# EAGLE design GL42 (EAGLE 6.5.0)
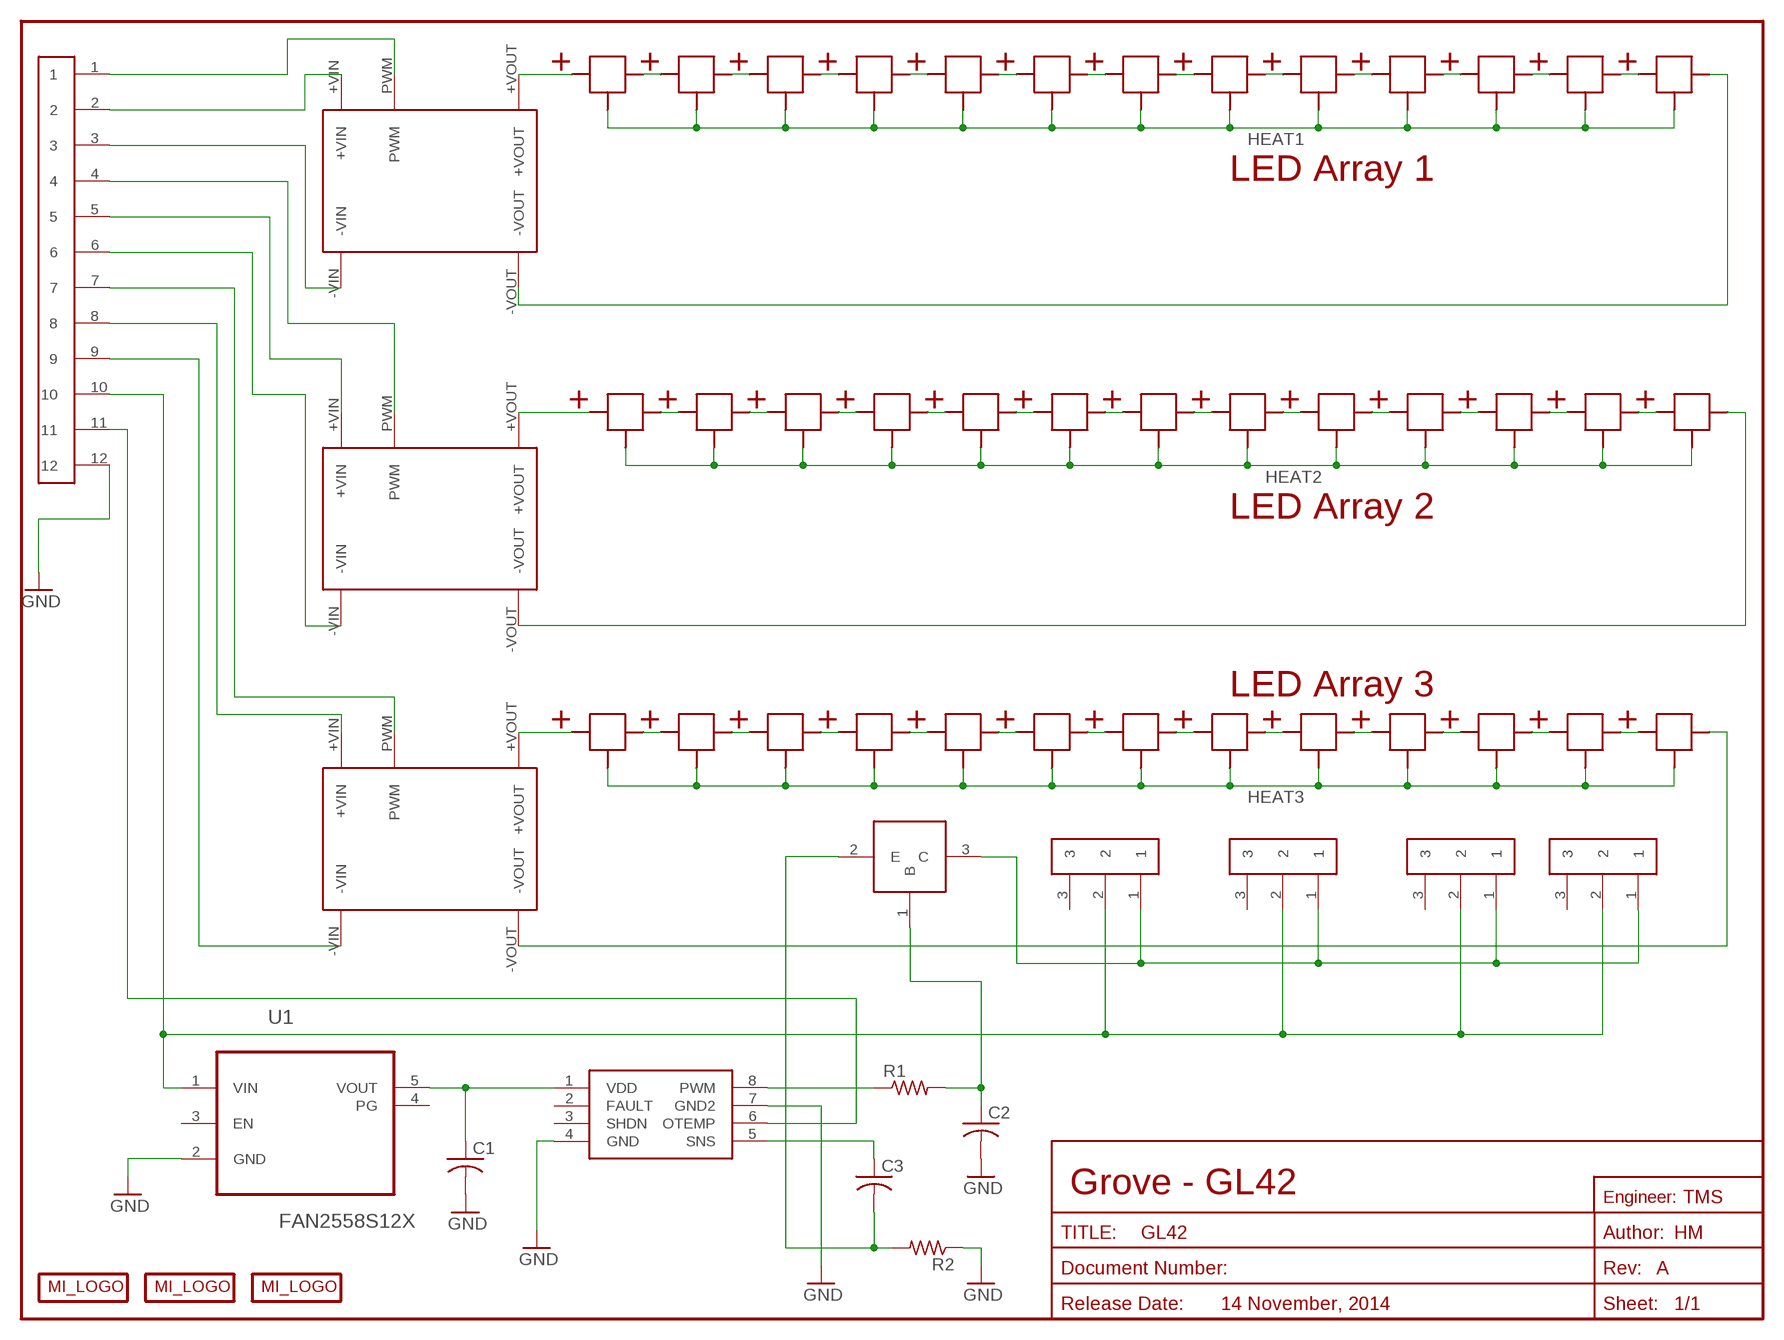
[diagram p0: schematic, sheet 1]

## Parts
C1  C-USC1206  [C1206]
C2  C-USC1206  [C1206]
C3  C-USC1206  [C1206]
R1  R-US_R1206  [R1206]
R2  R-US_R2512  [R2512]
U1  FAN2558S12X  [SOT95P280X145-5N]
U$1  CREE_XP  [XP]
U$2  CREE_XP  [XP]
U$3  CREE_XP  [XP]
U$4  CREE_XP  [XP]
U$5  CREE_XP  [XP]
U$6  CREE_XP  [XP]
U$7  CREE_XP  [XP]
U$8  CREE_XP  [XP]
U$9  CREE_XP  [XP]
U$10  CREE_XP  [XP]
U$11  CREE_XP  [XP]
U$12  CREE_XP  [XP]
U$13  CREE_XP  [XP]
U$14  TC652  [MSOP8]
U$15  PH14SMT  [PH14SMT]
U$16  LDD_HSMT  [LDD_HSMT]
U$17  LDD_HSMT  [LDD_HSMT]
U$18  LDD_HSMT  [LDD_HSMT]
U$19  CREE_XP  [XP]
U$20  CREE_XP  [XP]
U$21  CREE_XP  [XP]
U$22  CREE_XP  [XP]
U$23  CREE_XP  [XP]
U$24  CREE_XP  [XP]
U$25  CREE_XP  [XP]
U$26  CREE_XP  [XP]
U$27  CREE_XP  [XP]
U$28  CREE_XP  [XP]
U$29  CREE_XP  [XP]
U$30  CREE_XP  [XP]
U$31  CREE_XP  [XP]
U$32  CREE_XP  [XP]
U$33  CREE_XP  [XP]
U$34  CREE_XP  [XP]
U$35  CREE_XP  [XP]
U$36  CREE_XP  [XP]
U$37  CREE_XP  [XP]
U$38  CREE_XP  [XP]
U$39  CREE_XP  [XP]
U$40  CREE_XP  [XP]
U$41  CREE_XP  [XP]
U$42  CREE_XP  [XP]
U$43  CREE_XP  [XP]
U$44  CREE_XP  [XP]
U$45  NPN_POWERTRAN  [TO252]
U$46  PH3SMT  [PH3SMT]
U$47  PH3SMT  [PH3SMT]
U$48  PH3SMT  [PH3SMT]
U$49  PH3SMT  [PH3SMT]
U$50  MI_LOGO-GROVE  [GROVES_LOGO]
U$51  MI_LOGO-NAME_TWO  [MI_LOGO_NAME_2]
U$54  MI_LOGO-2014_USA  [MACRIS_USA_LOGO]

## Nets
GND: C1.2 C2.2 R2.1 U1.2(GND) U$14.4(GND) U$14.7(GND2) U$15.12
HEAT1: U$1.THERMAL U$2.THERMAL U$3.THERMAL U$4.THERMAL U$5.THERMAL U$6.THERMAL U$7.THERMAL U$8.THERMAL U$9.THERMAL U$10.THERMAL U$11.THERMAL U$12.THERMAL U$13.THERMAL
HEAT2: U$19.THERMAL U$20.THERMAL U$21.THERMAL U$22.THERMAL U$23.THERMAL U$24.THERMAL U$25.THERMAL U$26.THERMAL U$27.THERMAL U$28.THERMAL U$29.THERMAL U$30.THERMAL U$31.THERMAL
HEAT3: U$32.THERMAL U$33.THERMAL U$34.THERMAL U$35.THERMAL U$36.THERMAL U$37.THERMAL U$38.THERMAL U$39.THERMAL U$40.THERMAL U$41.THERMAL U$42.THERMAL U$43.THERMAL U$44.THERMAL
N$1: U$1.NEGATIVE U$1.NEGATIVE1(NEGATIVE) U$2.POSITIVE U$2.POSITIVE1(POSITIVE)
N$2: U$2.NEGATIVE U$2.NEGATIVE1(NEGATIVE) U$3.POSITIVE U$3.POSITIVE1(POSITIVE)
N$3: U$3.NEGATIVE U$3.NEGATIVE1(NEGATIVE) U$4.POSITIVE U$4.POSITIVE1(POSITIVE)
N$4: U$4.NEGATIVE U$4.NEGATIVE1(NEGATIVE) U$5.POSITIVE U$5.POSITIVE1(POSITIVE)
N$5: U$5.NEGATIVE U$5.NEGATIVE1(NEGATIVE) U$6.POSITIVE U$6.POSITIVE1(POSITIVE)
N$6: U$6.NEGATIVE U$6.NEGATIVE1(NEGATIVE) U$7.POSITIVE U$7.POSITIVE1(POSITIVE)
N$7: U$7.NEGATIVE U$7.NEGATIVE1(NEGATIVE) U$8.POSITIVE U$8.POSITIVE1(POSITIVE)
N$8: U$8.NEGATIVE U$8.NEGATIVE1(NEGATIVE) U$9.POSITIVE U$9.POSITIVE1(POSITIVE)
N$9: U$9.NEGATIVE U$9.NEGATIVE1(NEGATIVE) U$10.POSITIVE U$10.POSITIVE1(POSITIVE)
N$10: U$10.NEGATIVE U$10.NEGATIVE1(NEGATIVE) U$11.POSITIVE U$11.POSITIVE1(POSITIVE)
N$11: U$11.NEGATIVE U$11.NEGATIVE1(NEGATIVE) U$12.POSITIVE U$12.POSITIVE1(POSITIVE)
N$12: U$12.NEGATIVE U$12.NEGATIVE1(NEGATIVE) U$13.POSITIVE U$13.POSITIVE1(POSITIVE)
N$13: U$13.NEGATIVE U$13.NEGATIVE1(NEGATIVE) U$16.-VOUT
N$14: U$15.1 U$16.PWM
N$15: U$15.2 U$16.+VIN
N$16: U$15.3 U$16.-VIN
N$17: U$1.POSITIVE U$1.POSITIVE1(POSITIVE) U$16.+VOUT
N$18: C2.1 R1.2 U$45.1(B)
N$19: U$15.4 U$17.PWM
N$20: U$15.5 U$17.+VIN
N$21: U$15.6 U$17.-VIN
N$22: U$15.7 U$18.PWM
N$23: U$15.8 U$18.+VIN
N$24: U$15.9 U$18.-VIN
N$25: U$17.+VOUT U$19.POSITIVE U$19.POSITIVE1(POSITIVE)
N$26: U$19.NEGATIVE U$19.NEGATIVE1(NEGATIVE) U$20.POSITIVE U$20.POSITIVE1(POSITIVE)
N$27: U$20.NEGATIVE U$20.NEGATIVE1(NEGATIVE) U$21.POSITIVE U$21.POSITIVE1(POSITIVE)
N$28: U$21.NEGATIVE U$21.NEGATIVE1(NEGATIVE) U$22.POSITIVE U$22.POSITIVE1(POSITIVE)
N$29: U$22.NEGATIVE U$22.NEGATIVE1(NEGATIVE) U$23.POSITIVE U$23.POSITIVE1(POSITIVE)
N$30: U$23.NEGATIVE U$23.NEGATIVE1(NEGATIVE) U$24.POSITIVE U$24.POSITIVE1(POSITIVE)
N$31: U$24.NEGATIVE U$24.NEGATIVE1(NEGATIVE) U$25.POSITIVE U$25.POSITIVE1(POSITIVE)
N$32: U$25.NEGATIVE U$25.NEGATIVE1(NEGATIVE) U$26.POSITIVE U$26.POSITIVE1(POSITIVE)
N$33: U$26.NEGATIVE U$26.NEGATIVE1(NEGATIVE) U$27.POSITIVE U$27.POSITIVE1(POSITIVE)
N$34: U$27.NEGATIVE U$27.NEGATIVE1(NEGATIVE) U$28.POSITIVE U$28.POSITIVE1(POSITIVE)
N$35: U$28.NEGATIVE U$28.NEGATIVE1(NEGATIVE) U$29.POSITIVE U$29.POSITIVE1(POSITIVE)
N$36: U$29.NEGATIVE U$29.NEGATIVE1(NEGATIVE) U$30.POSITIVE U$30.POSITIVE1(POSITIVE)
N$37: U$30.NEGATIVE U$30.NEGATIVE1(NEGATIVE) U$31.POSITIVE U$31.POSITIVE1(POSITIVE)
N$38: U$17.-VOUT U$31.NEGATIVE U$31.NEGATIVE1(NEGATIVE)
N$39: U$18.+VOUT U$32.POSITIVE U$32.POSITIVE1(POSITIVE)
N$40: U$32.NEGATIVE U$32.NEGATIVE1(NEGATIVE) U$33.POSITIVE U$33.POSITIVE1(POSITIVE)
N$41: U$33.NEGATIVE U$33.NEGATIVE1(NEGATIVE) U$34.POSITIVE U$34.POSITIVE1(POSITIVE)
N$42: U$34.NEGATIVE U$34.NEGATIVE1(NEGATIVE) U$35.POSITIVE U$35.POSITIVE1(POSITIVE)
N$43: U$35.NEGATIVE U$35.NEGATIVE1(NEGATIVE) U$36.POSITIVE U$36.POSITIVE1(POSITIVE)
N$44: U$36.NEGATIVE U$36.NEGATIVE1(NEGATIVE) U$37.POSITIVE U$37.POSITIVE1(POSITIVE)
N$45: U$37.NEGATIVE U$37.NEGATIVE1(NEGATIVE) U$38.POSITIVE U$38.POSITIVE1(POSITIVE)
N$46: U$38.NEGATIVE U$38.NEGATIVE1(NEGATIVE) U$39.POSITIVE U$39.POSITIVE1(POSITIVE)
N$47: U$39.NEGATIVE U$39.NEGATIVE1(NEGATIVE) U$40.POSITIVE U$40.POSITIVE1(POSITIVE)
N$48: U$40.NEGATIVE U$40.NEGATIVE1(NEGATIVE) U$41.POSITIVE U$41.POSITIVE1(POSITIVE)
N$49: U$41.NEGATIVE U$41.NEGATIVE1(NEGATIVE) U$42.POSITIVE U$42.POSITIVE1(POSITIVE)
N$50: U$42.NEGATIVE U$42.NEGATIVE1(NEGATIVE) U$43.POSITIVE U$43.POSITIVE1(POSITIVE)
N$51: U$43.NEGATIVE U$43.NEGATIVE1(NEGATIVE) U$44.POSITIVE U$44.POSITIVE1(POSITIVE)
N$52: U$18.-VOUT U$44.NEGATIVE U$44.NEGATIVE1(NEGATIVE)
N$53: C1.1 U1.5(VOUT) U$14.1(VDD)
N$54: R1.1 U$14.8(PWM)
N$56: C3.2 R2.2 U$45.2(E)
N$57: U$14.6(OTEMP) U$15.11
N$58: U1.1(VIN) U$15.10 U$46.2 U$47.2 U$48.2 U$49.2
N$59: C3.1 U$14.5(SNS)
N$60: U$45.3(C) U$46.1 U$47.1 U$48.1 U$49.1
Unconnected: U1.3(EN) U1.4(PG) U$14.2(FAULT) U$14.3(SHDN) U$46.3 U$47.3 U$48.3 U$49.3

## Notes on the sheet
- LED Array 1
- LED Array 2
- LED Array 3
- Grove - GL42
- TMS
- HM
- A
- 14 November, 2014

## Library data of the parts
C1-C3 = adafruit:C-US: CAPACITOR, American symbol
R1 R2 = adafruit:R-US_: RESISTOR, American symbol
U1 = Fairchild_By_element14_Batch_1:FAN2558S12X: 180mA Low Voltage CMOS LDO; MPN: FAN2558S12X; OC_FARNELL: 1262829; OC_NEWARK: 82H9204; PACKAGE: SOT-23-5; SUPPLIER: Fairchild
U$1-U$13 U$19-U$44 = Cree_XP:CREE_XP
U$14 = zetex:TC652
U$15 = MacrisCustom:PH14SMT
U$16-U$18 = MacrisCustom:LDD_HSMT
U$45 = transistor-fet:NPN_POWERTRAN
U$46-U$49 = MacrisCustom:PH3SMT
U$50 U$51 U$54 = Logo:MI_LOGO

## Board
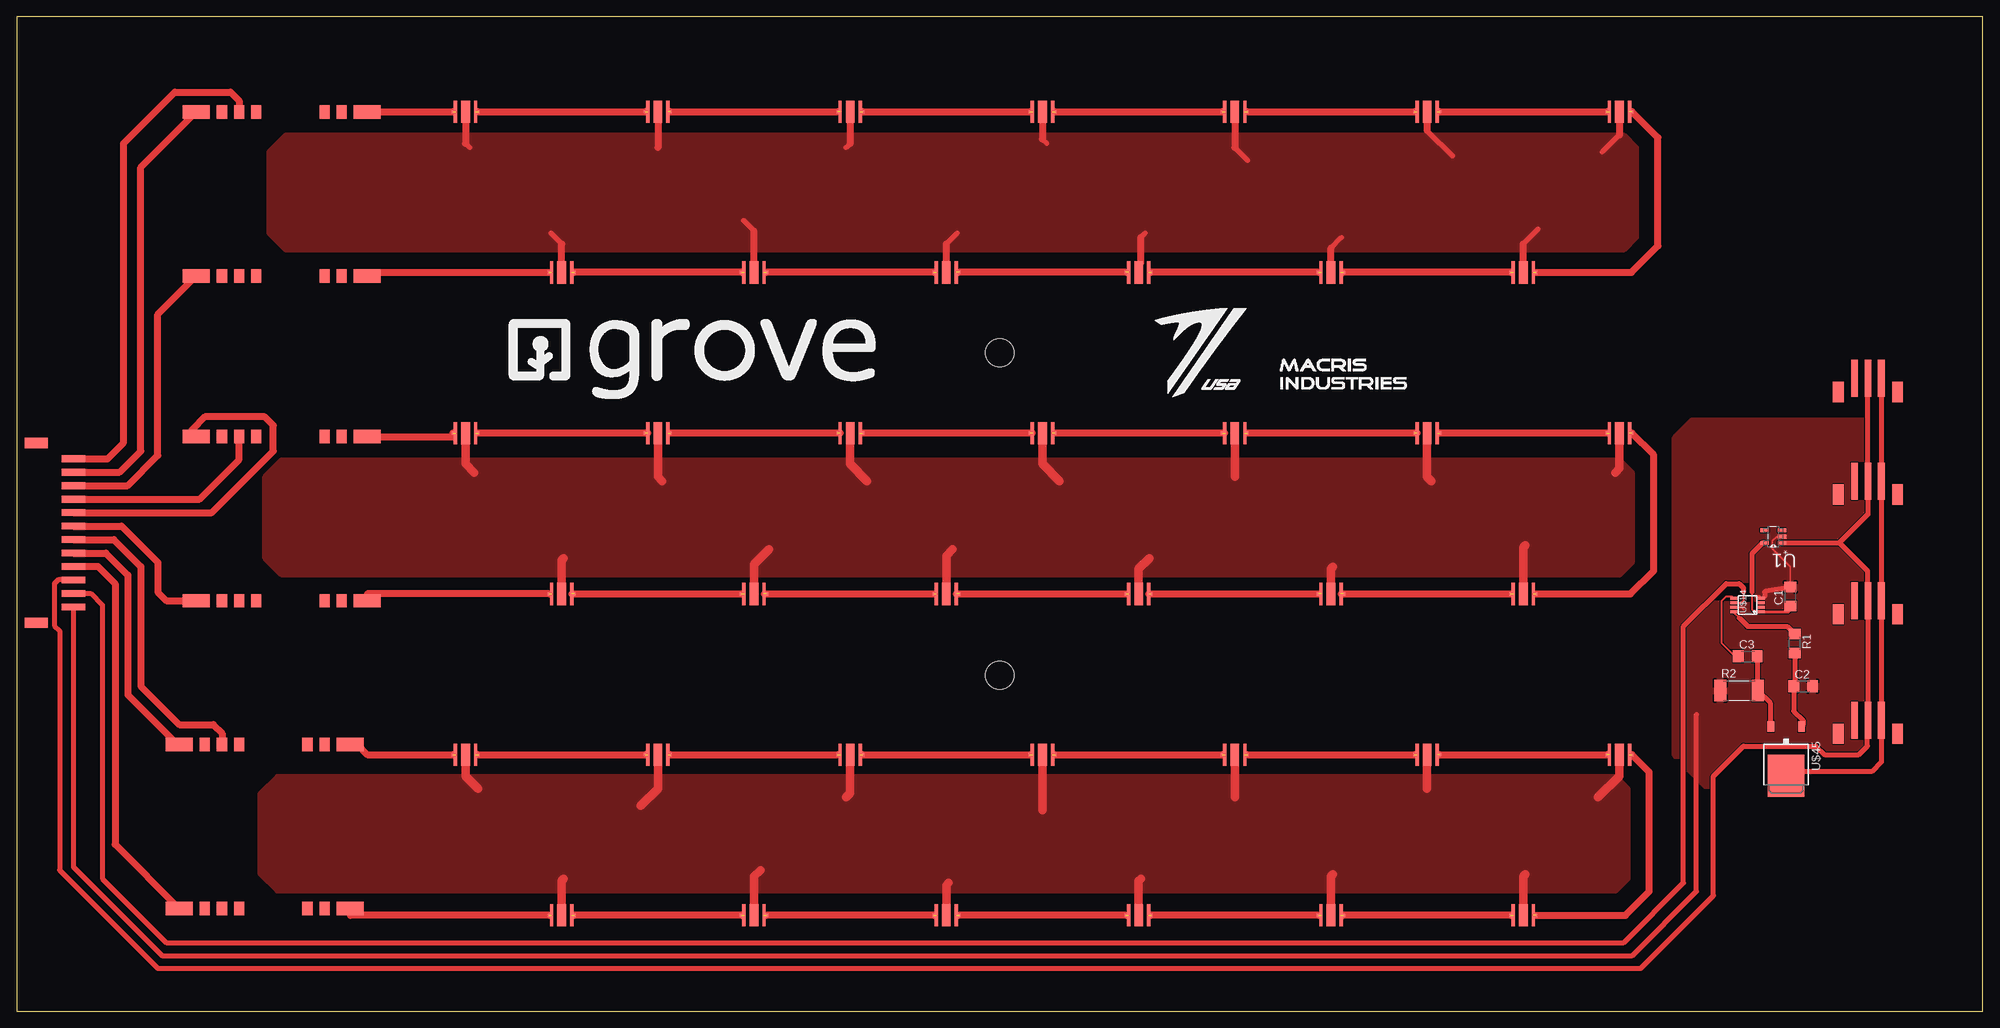
[diagram p1: board, top side]

Size 292.1 x 147.7 mm. Coordinates in mm from the lower left corner, seen from the top.
Outline: 0,0 292.1,0 292.1,147.7 0,147.7 0,0
Copper layers (1*16): Top 0.0356mm / dielectric 1.5011mm / Bottom 0.0356mm
Design rules "oshPark": minimum track width 6mil, minimum drill 13mil, track to track 6mil, track to pad 6mil, pad to pad 6mil, via to via 6mil, smd to smd 6mil, copper to edge 15mil, drill to drill 6mil, minimum pad ring 7mil, minimum via ring 7mil, stop-mask expansion 4mil, vias tented up to drill 0mil, thermal gap 10mil

### Footprints (pad centres in the part's own frame; a part is rotated, then mirrored left to right if it is on the bottom)
C1206 = smd 1.6 x 1.8: 1 -1.4,0; 2 1.4,0
R1206 = smd 1.6 x 1.803: 1 -1.422,0; 2 1.422,0
R2512 = smd 1.8 x 3.2: 1 -2.8,0; 2 2.8,0
SOT95P280X145-5N = smd 1.27 x 0.559: 1 -1.295,0.94; 2 -1.295,0; 3 -1.295,-0.94; 4 1.295,-0.94; 5 1.295,0.94
XP = smd 0.5 x 3.3: NEGATIVE 1.5,0; POSITIVE -1.5,0 | smd 0.4 x 0.5: NEGATIVE1 1.85,0; POSITIVE1 -1.85,0 | smd 1.3 x 3.3: THERMAL 0,0
MSOP8 = smd 0.45 x 1: 1 -0.975,-2.05; 2 -0.325,-2.05; 3 0.325,-2.05; 4 0.975,-2.05; 5 0.975,2.05; 6 0.325,2.05; 7 -0.325,2.05; 8 -0.975,2.05
PH14SMT = smd 3.5 x 1: 1 -1.75,-0.5; 2 -1.75,-2.5; 3 -1.75,-4.5; 4 -1.75,-6.5; 5 -1.75,-8.5; 6 -1.75,-10.5; 7 -1.75,-12.5; 8 -1.75,-14.5; 9 -1.75,-16.5; 10 -1.75,-18.5; 11 -1.75,-20.5; 12 -1.75,-22.5 | smd 3.4 x 1.5: W1 -7.3,1.85; W2 -7.3,-24.85
LDD_HSMT = smd 4 x 2: +VIN 0,24.37; +VOUT 25.4,24.37; -VIN 0,0; -VOUT 25.4,0 | smd 1.5 x 2: P$2 3.81,0; P$3 6.35,0; P$4 8.89,0; P$5 19.05,0; P$6 21.59,0; P$9 3.81,24.37; P$11 8.89,24.37; P$12 19.05,24.37; P$13 21.59,24.37; PWM 6.35,24.37
TO252 = smd 1 x 1.6: 1 -2.28,-4.8; 2 2.28,-4.8 | smd 5.4 x 6.2: 3 0,2.5
PH3SMT = smd 5.5 x 1: 1 0,-4; 2 0,-2; 3 0,0 | smd 3 x 1.6: P$4 -2,2.4; P$5 -2,-6.4
FOOT#8 = hole 4.191: 0,0

### Placement (x,y rotation side)
C1  263.52,61.59 90 top
C2  265.43,48.26 0 top
C3  257.18,52.7 0 top
R1  264.16,54.61 270 top
R2  255.91,47.62 0 top
U1  260.99,70.48 180 top
U$1  66.67,133.6 0 top
U$2  95.25,133.6 0 top
U$3  123.83,133.6 0 top
U$4  152.4,133.6 0 top
U$5  180.97,133.6 0 top
U$6  209.55,133.6 0 top
U$7  238.12,133.6 0 top
U$8  223.84,109.73 180 top
U$9  195.26,109.73 180 top
U$10  166.69,109.73 180 top
U$11  138.11,109.73 180 top
U$12  109.54,109.73 180 top
U$13  80.96,109.73 180 top
U$14  257.18,60.33 90 top
U$15  10.16,82.55 0 top
U$16  26.67,109.22 0 top
U$17  26.67,60.96 0 top
U$18  24.13,15.24 0 top
U$19  66.67,85.85 0 top
U$20  95.25,85.85 0 top
U$21  123.83,85.85 0 top
U$22  152.4,85.85 0 top
U$23  180.97,85.85 0 top
U$24  209.55,85.85 0 top
U$25  238.12,85.85 0 top
U$26  223.84,61.98 180 top
U$27  195.26,61.98 180 top
U$28  166.69,61.98 180 top
U$29  138.11,61.98 180 top
U$30  109.54,61.98 180 top
U$31  80.96,61.98 180 top
U$32  66.67,38.1 0 top
U$33  95.25,38.1 0 top
U$34  123.83,38.1 0 top
U$35  152.4,38.1 0 top
U$36  180.97,38.1 0 top
U$37  209.55,38.1 0 top
U$38  238.12,38.1 0 top
U$39  223.84,14.22 180 top
U$40  195.26,14.22 180 top
U$41  166.69,14.22 180 top
U$42  138.11,14.22 180 top
U$43  109.54,14.22 180 top
U$44  80.96,14.22 180 top
U$45  262.89,37.47 180 top
U$46  273.05,93.98 90 top
U$47  273.05,78.74 90 top
U$48  273.05,60.96 90 top
U$49  273.05,43.18 90 top
U$50  68.58,87.63 0 top
U$51  187.32,92.08 0 top
U$52  [FOOT#8]  146.05,49.89 0 top
U$53  [FOOT#8]  146.05,97.79 0 top
U$54  168.28,90.17 0 top

### Tracks (layer width: path | path; a pad name or v marks a point on that pad's centre or on a via)
GND
  Top 0.254: 259.71,61.59 259.52,61.59 U$14.4 | C1.2 263.52,66.04 260.86,68.71 260.86,69.85 261.49,70.48 U1.2
  Top 0.305: U$14.7 256.23,60 256.54,59.69
  Top 0.457: 258.44,61.59 258.93,61.59 U$14.4
  Top 0.762: U$15.12 8.41,21.43 21.59,8.26 240.03,8.26 249.56,17.78 249.56,44.08 | C1.2 259.85,62.36 259.71,62.23 259.71,61.59
  pour Top: 248.92,87.63 246.38,85.09 246.38,38.1 252.09,32.38 281.31,32.38 287.02,38.1 287.02,83.82 283.21,87.63
HEAT1
  Top 0.762: 66.67,128.91 67.31,128.27 | 80.96,113.98 79.38,115.57 | 109.54,115.89 107.95,117.47 | 123.83,128.91 123.19,128.27 | 138.11,113.98 139.7,115.57 | 152.4,129.54 153.03,128.91 | U$10.THERMAL 166.69,110.81 167,111.12 | 167,114.94 167.64,115.57 | 180.97,128.27 182.88,126.36 | 195.26,113.35 196.85,114.94 | 209.55,130.81 213.36,127 | 223.84,113.98 226.06,116.2 | 238.12,130.18 235.59,127.64
  Top 1.016: U$1.THERMAL 66.67,128.91 | U$13.THERMAL 80.96,113.98 | U$2.THERMAL 95.25,128.27 | U$12.THERMAL 109.54,115.89 | U$3.THERMAL 123.83,128.91 | U$11.THERMAL 138.11,113.98 | U$4.THERMAL 152.4,129.54 | 167,111.12 167,114.94 | U$5.THERMAL 180.97,128.27 | U$9.THERMAL 195.26,113.35 | U$6.THERMAL 209.55,130.81 | U$8.THERMAL 223.84,113.98 | U$7.THERMAL 238.12,130.18
  pour Top: 40.01,130.18 238.76,130.18 240.66,128.27 240.66,114.94 238.76,113.03 40.01,113.03 37.47,115.57 37.47,127.64
HEAT2
  Top 1.27: U$23.THERMAL 180.97,79.38 | U$27.THERMAL 195.26,65.72 195.58,66.04 | U$24.THERMAL 209.55,79.38 210.19,78.74 | U$26.THERMAL 223.84,68.9 224.16,69.22 | U$19.THERMAL 66.67,81.28 67.94,80.01 | U$31.THERMAL 80.96,66.99 81.28,67.31 | U$20.THERMAL 95.25,79.38 95.89,78.74 | U$30.THERMAL 109.54,66.36 111.76,68.58 | U$21.THERMAL 123.83,81.28 126.36,78.74 | U$29.THERMAL 138.11,67.63 139.06,68.58 | U$22.THERMAL 152.4,81.28 154.94,78.74 | U$28.THERMAL 166.69,65.72 168.28,67.31 | U$25.THERMAL 238.12,80.64 237.49,80.01
  pour Top: 39.37,81.92 238.12,81.92 240.03,80.01 240.03,66.67 238.12,64.77 39.37,64.77 36.83,67.31 36.83,79.38
HEAT3
  Top 1.27: U$38.THERMAL 238.12,34.92 234.95,31.75 | U$39.THERMAL 223.84,20 224.16,20.32 | U$37.THERMAL 209.55,33.02 | U$40.THERMAL 195.26,20 195.58,20.32 | U$36.THERMAL 180.97,31.75 | U$41.THERMAL 166.69,19.37 167,19.68 | U$35.THERMAL 152.4,29.84 | U$42.THERMAL 138.11,18.73 138.43,19.05 | U$43.THERMAL 109.54,20 110.49,20.95 | U$34.THERMAL 123.83,32.38 123.19,31.75 | U$33.THERMAL 95.25,33.02 92.71,30.48 | U$32.THERMAL 66.67,34.92 68.58,33.02 | U$44.THERMAL 80.96,19.37 81.28,19.68
  pour Top: 38.73,34.92 237.49,34.92 239.4,33.02 239.4,19.68 237.49,17.78 38.73,17.78 36.2,20.32 36.2,32.38
N$1  (2 unrouted)
  Top 1.016: U$1.NEGATIVE1 U$2.POSITIVE1
N$2  (2 unrouted)
  Top 1.016: U$2.NEGATIVE1 U$3.POSITIVE1
N$3  (2 unrouted)
  Top 1.016: U$3.NEGATIVE1 U$4.POSITIVE1
N$4  (2 unrouted)
  Top 1.016: U$4.NEGATIVE1 U$5.POSITIVE1
N$5  (2 unrouted)
  Top 1.016: U$5.NEGATIVE1 U$6.POSITIVE1
N$6  (2 unrouted)
  Top 1.016: U$6.NEGATIVE1 U$7.POSITIVE1
N$7  (2 unrouted)
  Top 1.016: U$8.POSITIVE1 239.9,109.73 243.84,113.67 243.84,129.74 U$7.NEGATIVE1
N$8  (2 unrouted)
  Top 1.016: U$8.NEGATIVE1 U$9.POSITIVE1
N$9  (2 unrouted)
  Top 1.016: U$9.NEGATIVE1 U$10.POSITIVE1
N$10  (2 unrouted)
  Top 1.016: U$10.NEGATIVE1 U$11.POSITIVE1
N$11  (2 unrouted)
  Top 1.016: U$11.NEGATIVE1 U$12.POSITIVE1
N$12  (2 unrouted)
  Top 1.016: U$12.NEGATIVE1 U$13.POSITIVE1
N$13  (1 unrouted)
  Top 1.016: U$16.-VOUT 53.21,109.22 53.72,109.73 U$13.NEGATIVE1
N$14
  Top 1.016: U$15.1 13.47,82.05 15.88,84.45 15.88,128.91 23.5,136.53 31.75,136.53 33.02,135.25 U$16.PWM
N$15
  Top 1.016: U$15.2 15.28,80.05 18.41,83.19 18.41,125.33 U$16.+VIN
N$16
  Top 1.016: U$15.3 16.45,78.05 20.95,82.55 20.95,103.5 U$16.-VIN
N$17  (1 unrouted)
  Top 1.016: U$16.+VOUT U$1.POSITIVE1
N$18
  Top 0.762: U$45.1 265.43,42.52 265.43,43.18 264.03,44.58 C2.1 264.16,48.39 R1.2
N$19
  Top 1.016: U$15.4 27.16,76.05 33.02,81.92 U$17.PWM
N$20
  Top 1.016: U$15.5 28.96,74.05 38.1,83.19 38.1,87 36.83,88.27 27.94,88.27 26.04,86.36 26.04,85.97 U$17.+VIN
N$21
  Top 1.016: U$15.6 15.58,72.05 20.95,66.67 20.95,62.23 22.23,60.96 U$17.-VIN
N$22
  Top 1.016: U$15.7 14.4,70.05 18.41,66.04 18.41,48.26 24.13,42.55 29.21,42.55 30.48,41.27 U$18.PWM
N$23
  Top 1.016: U$15.8 13.23,68.05 16.51,64.77 16.51,46.99 23.5,40.01 23.73,40.01 U$18.+VIN
N$24
  Top 1.016: U$15.9 12.05,66.05 14.61,63.5 14.61,24.77 U$18.-VIN
N$25  (1 unrouted)
  Top 1.016: U$17.+VOUT 64.83,85.33 U$19.POSITIVE1
N$26  (2 unrouted)
  Top 1.016: U$20.POSITIVE U$19.NEGATIVE1
N$27  (2 unrouted)
  Top 1.016: U$21.POSITIVE U$20.NEGATIVE1
N$28  (2 unrouted)
  Top 1.016: U$22.POSITIVE U$21.NEGATIVE1
N$29  (2 unrouted)
  Top 1.016: U$23.POSITIVE U$22.NEGATIVE1
N$30  (2 unrouted)
  Top 1.016: U$24.POSITIVE U$23.NEGATIVE1
N$31  (2 unrouted)
  Top 1.016: U$25.POSITIVE1 U$24.NEGATIVE1
N$32  (2 unrouted)
  Top 1.016: U$26.POSITIVE1 239.78,61.98 243.21,65.41 243.21,82.62 U$25.NEGATIVE1
N$33  (2 unrouted)
  Top 1.016: U$27.POSITIVE U$26.NEGATIVE1
N$34  (2 unrouted)
  Top 1.016: U$28.POSITIVE U$27.NEGATIVE1
N$35  (2 unrouted)
  Top 1.016: U$29.POSITIVE U$28.NEGATIVE1
N$36  (2 unrouted)
  Top 1.016: U$30.POSITIVE U$29.NEGATIVE1
N$37  (2 unrouted)
  Top 1.016: U$31.POSITIVE U$30.NEGATIVE1
N$38  (1 unrouted)
  Top 1.016: U$31.NEGATIVE1 52.07,61.98 U$17.-VOUT
N$39  (1 unrouted)
  Top 1.016: U$18.+VOUT 50.56,39.61 52.07,38.1 U$32.POSITIVE1
N$40  (2 unrouted)
  Top 1.016: U$32.NEGATIVE1 U$33.POSITIVE1
N$41  (2 unrouted)
  Top 1.016: U$33.NEGATIVE1 U$34.POSITIVE1
N$42  (2 unrouted)
  Top 1.016: U$34.NEGATIVE1 U$35.POSITIVE1
N$43  (2 unrouted)
  Top 1.016: U$35.NEGATIVE1 U$36.POSITIVE1
N$44  (2 unrouted)
  Top 1.016: U$36.NEGATIVE1 U$37.POSITIVE1
N$45  (2 unrouted)
  Top 1.016: U$37.NEGATIVE1 U$38.POSITIVE1
N$46  (2 unrouted)
  Top 1.016: U$39.POSITIVE1 239.01,14.22 242.57,17.78 242.57,35.51 U$38.NEGATIVE1
N$47  (2 unrouted)
  Top 1.016: U$39.NEGATIVE1 U$40.POSITIVE1
N$48  (2 unrouted)
  Top 1.016: U$40.NEGATIVE1 U$41.POSITIVE1
N$49  (2 unrouted)
  Top 1.016: U$41.NEGATIVE1 U$42.POSITIVE1
N$50  (2 unrouted)
  Top 1.016: U$42.NEGATIVE1 U$43.POSITIVE1
N$51  (2 unrouted)
  Top 1.016: U$43.NEGATIVE1 U$44.POSITIVE1
N$52  (1 unrouted)
  Top 1.016: U$44.NEGATIVE1 49.53,14.22 U$18.-VOUT
N$53
  Top 0.305: 258.15,59.35 257.81,59.69 257.81,62.23
  Top 0.457: C1.1 263.31,59.35 U$14.1 258.15,59.35
  Top 0.762: U1.5 259.41,69.55 257.81,67.94 257.81,62.23
N$54
  Top 0.305: U$14.8 255.12,59.2 255.91,58.42
  Top 0.762: 255.91,58.42 257.18,57.15 263.04,57.15 R1.1
N$56
  Top 0.762: U$45.2 260.61,45.72 R2.2 258.7,52.58 C3.2
N$57
  Top 0.305: U$14.6 256.23,60.65 256.54,60.96 256.54,62.23
  Top 0.762: U$15.11 10.97,62.05 12.7,60.33 12.7,19.68 22.23,10.16 238.76,10.16 247.65,19.05 247.65,57.15 254,63.5 255.91,63.5 256.54,62.87 256.54,62.23
N$58
  Top 0.762: U1.1 270.81,69.55 | 270.81,69.55 274.95,65.41 274.95,61.05 U$48.2 275.05,43.91 274.95,43.81 274.95,43.27 U$49.2 274.95,43.09 274.95,39.37 273.69,38.1 268.61,38.1 267.33,39.37 256.54,39.37 252.09,34.92 252.09,17.14 241.3,6.35 20.95,6.35 6.35,20.95 6.35,56.52 5.59,57.28 5.59,63.5 6.14,64.05 U$15.10 | U$46.2 U$47.2 275.05,73.78 270.81,69.55
N$59
  Top 0.305: C3.1 255.27,52.7 253.37,54.61 253.37,60.96 254,61.59 254.83,61.59 U$14.5
N$60
  Top 0.762: U$46.1 U$47.1 U$48.1 U$49.1 277.05,37.02 275.59,35.56 263.49,35.56 U$45.3

### Text on the board
Document: 11.50" | 5.750" | 5.815"